# Altium schematic sheet TIDA-00830_DRV888x.SchDoc: DRV888xEVM Motor Driver Connections
size 431 x 279 mm; Date: Not shown in title block; ApprovedBy: Not shown in title block; CheckedBy: Not shown in title block; Author: Not shown in title block; CompanyName: Not shown in title block; Engineer: Not shown in title block; Organization: Not shown in title block; Address1: Not shown in title block; Address2: Not shown in title block; Address3: Not shown in title block; Address4: Not shown in title block; DocumentNumber: 1; Revision: Use project parameter SCH_Rev; SheetNumber: 1; SheetTotal: 3; PageSetup: Record=PageOptions|CenterHorizontal=True|CenterVertical=True|PrintScale=1.00|XCorrection=1.00|YCorrection=1.00|PrintKind=0|BorderSize=5000000|LeftOffset=0|BottomOffset=0|Orientation=2|PaperLength=1000|PaperWidth=1000|Scale=100|PaperSource=15|PrintQuality=600|MediaType=1|DitherType=10|PaperKind=Letter|PrintScaleMode=1; CurrentTime: Not shown in title block; CurrentDate: Not shown in title block; Time: Not shown in title block; DocumentFullPathAndName: Not shown in title block; DocumentName: Not shown in title block; ModifiedDate: Not shown in title block; ImagePath: Not shown in title block
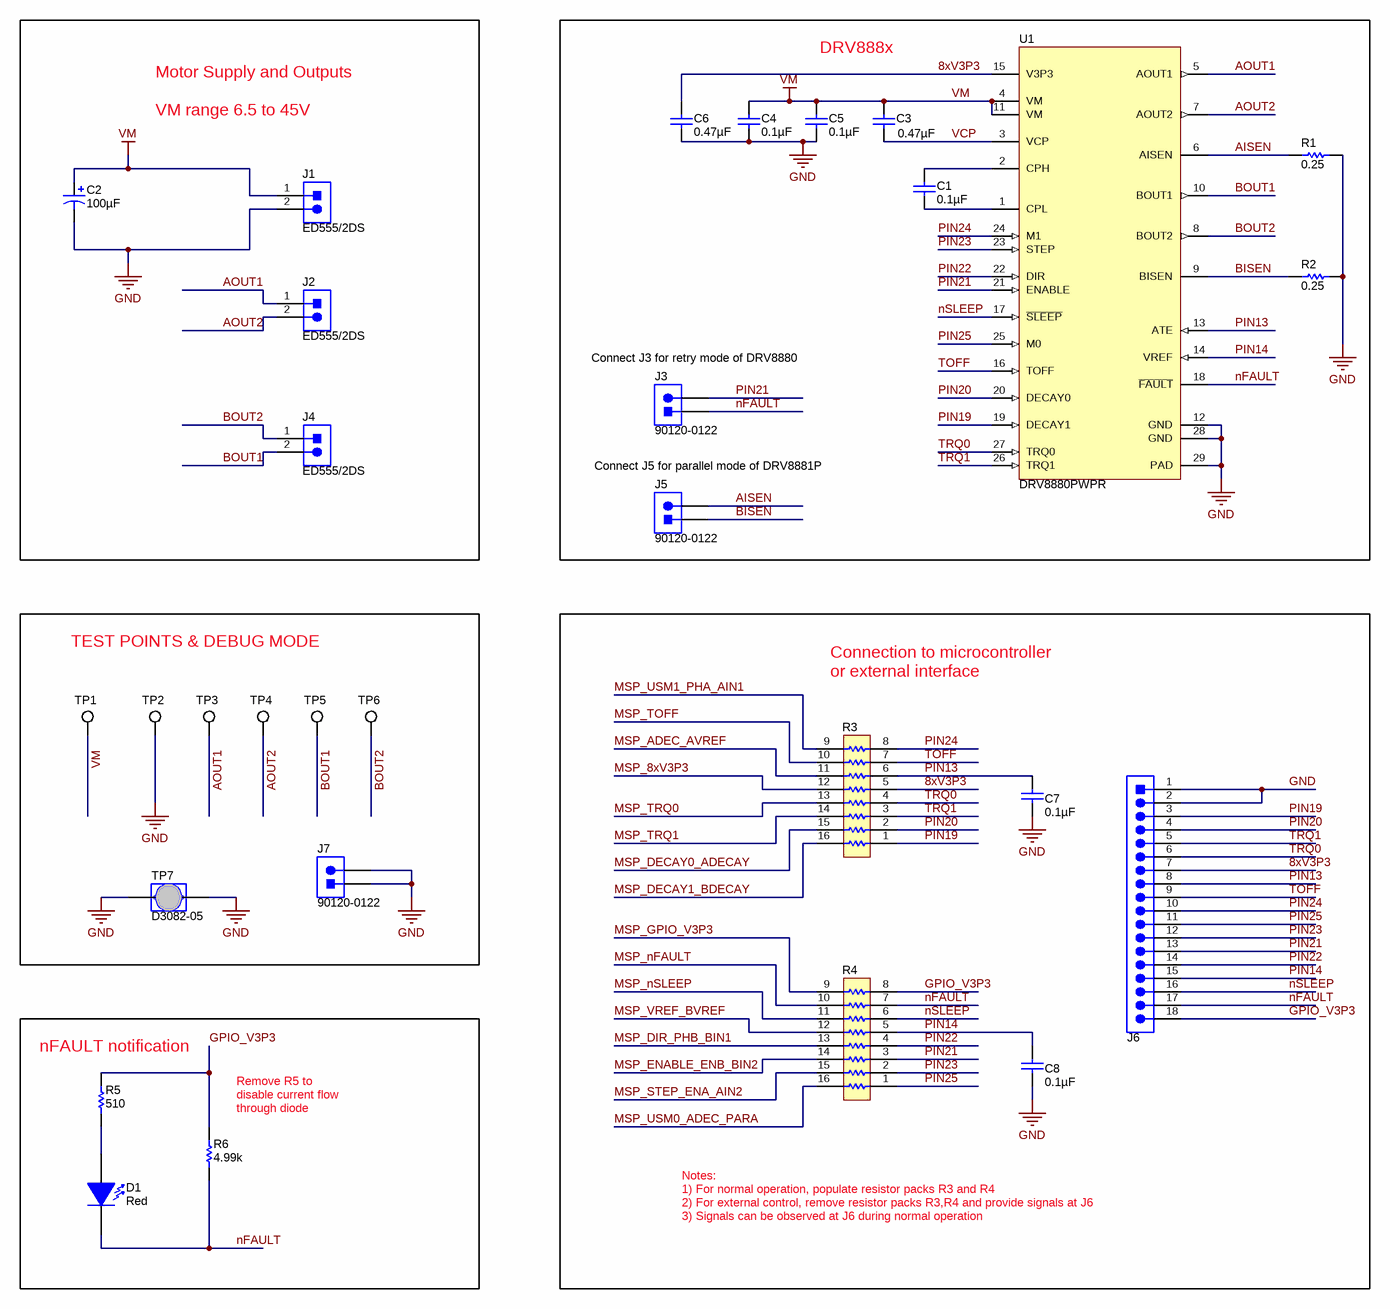
[diagram p0: TIDA-00830_DRV888x.SchDoc]

## Parts
C1  ValueDisplayed: 0.1µF  [0805L]  (hidden comment: C0805C104K1RACTU)
C2  ValueDisplayed: 100µF  [SM_RADIAL_G]  (hidden comment: EEE-FK1J101P)
C3  ValueDisplayed: 0.47µF  [0805L]  (hidden comment: C2012X7R1E474K)
C4  ValueDisplayed: 0.1µF  [0805L]  (hidden comment: C0805C104K1RACTU)
C5  ValueDisplayed: 0.1µF  [0805L]  (hidden comment: C0805C104K1RACTU)
C6  ValueDisplayed: 0.47µF  [0603L]  (hidden comment: C0603C474K9RACTU)
C7  ValueDisplayed: 0.1µF  [0402L]  (hidden comment: GRM155R61A104KA01D)
C8  ValueDisplayed: 0.1µF  [0402L]  (hidden comment: GRM155R61A104KA01D)
D1  value Red  [LED_LTST-C190_Red]  (hidden comment: LTST-C190CKT)
J1  ED555/2DS  [TERM_BLK_ED555-2DS]
J2  ED555/2DS  [TERM_BLK_ED555-2DS]
J3  90120-0122  [CONN_90120-0122]
J4  ED555/2DS  [TERM_BLK_ED555-2DS]
J5  90120-0122  [CONN_90120-0122]
J6  TSW-118-07-G-S  [TSW-118-07-G-S]  (value not drawn)
J7  90120-0122  [CONN_90120-0122]
R1  value 0.25  [2010L]  (hidden comment: CSRN2010FKR250)
R2  value 0.25  [2010L]  (hidden comment: CSRN2010FKR250)
R3  EXB-2HV330JV  [RESCAXS_EXB-2HV]  (value not drawn)
R4  EXB-2HV330JV  [RESCAXS_EXB-2HV]  (value not drawn)
R5  value 510  [0402L]  (hidden comment: CRCW0402510RJNED)
R6  value 4.99k  [0402L]  (hidden comment: CRCW04024K99FKED)
TP1  5016  [Testpoint_Keystone_Compact]  (value not drawn)
TP2  5016  [Testpoint_Keystone_Compact]  (value not drawn)
TP3  5016  [Testpoint_Keystone_Compact]  (value not drawn)
TP4  5016  [Testpoint_Keystone_Compact]  (value not drawn)
TP5  5016  [Testpoint_Keystone_Compact]  (value not drawn)
TP6  5016  [Testpoint_Keystone_Compact]  (value not drawn)
TP7  D3082-05  [Harwin_D3082-05]
U1  DRV8880PWPR  [PWP0028C_N]

## Blocks framed on the sheet
DRV888x: C1 C3-C6 J3 J5 R1 R2 U1
TEST POINTS & DEBUG MODE: J7 TP1-TP7
nFAULT notification: D1 R5 R6

## Nets
GND: C2.2(-) C4.1 C5.1 C6.2 C7.2 C8.2 J1.2 J6.1 J6.2 J7.1 J7.2 R1.1 R2.1 TP2.1 TP7.1 TP7.2 U1.12(GND) U1.28(GND) U1.29(PAD)
VM: C2.1(+) C3.2 C4.2 C5.2 J1.1 TP1.1 U1.4(VM) U1.11(VM)
8xV3P3: C6.1 J6.7 R3.5 U1.15(V3P3)
AISEN: J5.2 R1.2 U1.6(AISEN)
AOUT1: J2.1 TP3.1 U1.5(AOUT1)
AOUT2: J2.2 TP4.1 U1.7(AOUT2)
BISEN: J5.1 R2.2 U1.9(BISEN)
BOUT1: J4.2 TP5.1 U1.10(BOUT1)
BOUT2: J4.1 TP6.1 U1.8(BOUT2)
GPIO_V3P3: J6.18 R4.8 R5.2 R6.2
MSP_8xV3P3: R3.12
MSP_ADEC_AVREF: R3.11
MSP_DECAY0_ADECAY: R3.15
MSP_DECAY1_BDECAY: R3.16
MSP_DIR_PHB_BIN1: R4.13
MSP_ENABLE_ENB_BIN2: R4.14
MSP_GPIO_V3P3: R4.9
MSP_nFAULT: R4.10
MSP_nSLEEP: R4.11
MSP_STEP_ENA_AIN2: R4.15
MSP_TOFF: R3.10
MSP_TRQ0: R3.13
MSP_TRQ1: R3.14
MSP_USM0_ADEC_PARA: R4.16
MSP_USM1_PHA_AIN1: R3.9
MSP_VREF_BVREF: R4.12
nFAULT: D1.2(K) J3.1 J6.17 R4.7 R6.1 U1.18(~{FAULT})
nSLEEP: J6.16 R4.6 U1.17(~{SLEEP})
PIN13: C7.1 J6.8 R3.6 U1.13(ATE)
PIN14: C8.1 J6.15 R4.5 U1.14(VREF)
PIN19: J6.3 R3.1 U1.19(DECAY1)
PIN20: J6.4 R3.2 U1.20(DECAY0)
PIN21: J3.2 J6.13 R4.3 U1.21(ENABLE)
PIN22: J6.14 R4.4 U1.22(DIR)
PIN23: J6.12 R4.2 U1.23(STEP)
PIN24: J6.10 R3.8 U1.24(M1)
PIN25: J6.11 R4.1 U1.25(M0)
TOFF: J6.9 R3.7 U1.16(TOFF)
TRQ0: J6.6 R3.4 U1.27(TRQ0)
TRQ1: J6.5 R3.3 U1.26(TRQ1)
VCP: C3.1 U1.3(VCP)
NetC1_1: C1.1 U1.1(CPL)
NetC1_2: C1.2 U1.2(CPH)
NetD1_1: D1.1(A) R5.1

## Notes on the sheet
- Motor Supply and Outputs
  VM range 6.5 to 45V
- (near J3) Connect J3 for retry mode of DRV8880
- Connect J5 for parallel mode of DRV8881P
- Connection to microcontroller
  or external interface
- (near R6) Remove R5 to disable current flow through diode
- Notes:
  1) For normal operation, populate resistor packs R3 and R4
  2) For external control, remove resistor packs R3,R4 and provide signals at J6
  3) Signals can be observed at J6 during normal operation
- Drawn By:
- SVN Rev:
- Number:
- TID #:
- Orderable:
- Rev:
- Sheet Title:
- File:
- Project Title:
- Designed for:
- Assembly Variant:
- Mod. Date:
- Sheet:
- Size:
- of
- B
- http://www.ti.com
- Texas Instruments and/or its licensors do not warrant the accuracy or completeness of this specification or any information contained therein. Texas Instruments and/or its licensors do not warrant that this design will meet the specifications, will be suitable for your application or fit for any particular purpose, or will operate in an implementation. Texas Instruments and/or its licensors do not warrant that the design is production worthy. You should completely validate and test your design implementation to confirm the system functionality for your application.
- Engineer:
- Contact:
- © Texas Instruments

## Library data of the parts
C1 C4 C5 = C0805C104K1RACTU: CAP, CERM, 0.1 µF, 100 V, +/- 10%, X7R, 0805; Manufacturer: Kemet; Polarized: N; CompType: Capacitor; Value: 0.1uF; U/M: EA; Cap_F: 0.0000001; Tolerance_%: 10; ESR_ohm: 0.064; Value1: 0.064 ohm; VDC_V: 100; Value2: 100V; IRMS_A: 1.64; TaMin_C: -55; TaMax_C: 125; Cap_Case: 0805; SymbolVersion: 2008-07-09; PartNumber: C0805C104K1RACTU; PackageReference: 0805; RoHS: Y; MountType: SMT; Technology: Ceramic; TempCo: X7R; Published: 2008-06-19; Publisher: Texas Instruments; LatestRevisionDate: 2015-06-10; ComponentLink1Description: Datasheet link; ComponentLink1URL: http://www.kemet.com/kemet/web/homepage/kechome.nsf/file/Partial%20Copy%20-%20Ceramic%20Surface%20Mount%20Capacitors/$file/F3102_CE.pdf; Supplier 1: Digi-Key; Supplier Part Number 1: 399-3486-1-ND; Supplier 2: Mouser; Supplier Part Number 2: 80-C0805C104K1R; Supplier 3: Farnell; Supplier Part Number 3: 1650862
C2 = EEE-FK1J101P: CAP, AL, 100 µF, 63 V, +/- 20%, 0.35 ohm, SMD; Manufacturer: Panasonic; Value: 100uF; Polarized: Y; CompType: Capacitor; U/M: EA; Cap_F: 0.0001; Tolerance_%: 20; ESR_ohm: 0.35; VDC_V: 63; Value2: 63V; IRMS_A: 0.4; TaMin_C: -55; TaMax_C: 105; Cap_Case: G; SymbolVersion: 2008-07-09; PartNumber: EEE-FK1J101P; PackageReference: SMT Radial G; RoHS: Y; Value1: 0.35 ohm; MountType: SMT; Technology: AL; Publisher: Texas Instruments; LatestRevisionDate: 2015-06-10; ComponentLink1Description: Datasheet link; ComponentLink1URL: http://www.panasonic.com/industrial/components/pdf/smt_aec_050505.pdf; Supplier 1: Digi-Key; Supplier Part Number 1: PCE3819CT-ND; Supplier 2: Mouser; Supplier Part Number 2: 667-EEE-FK1J101P; Supplier 3: Farnell; Supplier Part Number 3: 9696040; Series: FK
C3 = C2012X7R1E474K: CAP, CERM, 0.47 µF, 25 V, +/- 10%, X7R, 0805; Manufacturer: TDK; Polarized: N; CompType: Capacitor; Value: 0.47uF; U/M: EA; Cap_F: 0.00000047; Tolerance_%: 10; ESR_ohm: 0.0101; Value1: 0.0101 ohm; VDC_V: 25; Value2: 25V; TaMin_C: -55; TaMax_C: 125; Cap_Case: 0805; SymbolVersion: 2008-07-09; PartNumber: C2012X7R1E474K; PackageReference: 0805; RoHS: Y; MountType: SMT; Technology: Ceramic; TempCo: X7R; Published: 2008-06-19; Publisher: Texas Instruments; LatestRevisionDate: 2015-06-10; ComponentLink1Description: Datasheet link; ComponentLink1URL: http://www.tdk.co.jp/tefe02/e412_c.pdf; Supplier 1: Digi-Key; Supplier Part Number 1: 445-1353-1-ND; Supplier 2: Farnell; Supplier Part Number 2: 1844282
C6 = C0603C474K9RACTU: CAP, CERM, 0.47 µF, 6.3 V, +/- 10%, X7R, 0603; Manufacturer: Kemet; Polarized: N; CompType: Capacitor; Value: 0.47uF; U/M: EA; Cap_F: 0.00000047; Tolerance_%: 10; Value1: Unknown; VDC_V: 6.3; Value2: 6.3V; TaMin_C: -55; TaMax_C: 125; Cap_Case: 0603; SymbolVersion: 2008-07-09; PartNumber: C0603C474K9RACTU; PackageReference: 0603; RoHS: Y; MountType: SMT; Technology: Ceramic; TempCo: X7R; Published: 2008-06-19; Publisher: Texas Instruments; LatestRevisionDate: 2015-06-10; ComponentLink1Description: Datasheet link; ComponentLink1URL: http://www.kemet.com/kemet/web/homepage/kechome.nsf/vapubfiles/F3102_Y5V.pdf/$file/F3102_Y5V.pdf; Supplier 1: Digi-Key; Supplier Part Number 1: 399-4924-1-ND; Supplier 2: Mouser; Supplier Part Number 2: 80-C0603C474K9R
C7 C8 = GRM155R61A104KA01D: CAP, CERM, 0.1 µF, 10 V, +/- 10%, X5R, 0402; Manufacturer: MuRata; Value: 0.1uF; Polarized: N; CompType: Capacitor; U/M: EA; Cap_F: 0.0000001; Tolerance_%: 10; Value1: Unknown; Value2: 10V; TaMin_C: -55; TaMax_C: 85; Cap_Case: 0402; SymbolVersion: 2008-07-09; PartNumber: GRM155R61A104KA01D; PackageReference: 0402; RoHS: Y; VDC_V: 10; MountType: SMT; Technology: Ceramic; TempCo: X5R; Published: 2008-06-19; Publisher: Texas Instruments; LatestRevisionDate: 2015-06-10; ComponentLink1Description: Datasheet link; ComponentLink1URL: http://search.murata.co.jp/Ceramy/PnsearchViewAction.do?HnOFG=ON&HnNFG=ON&SEL_CNT=50&sLang=en&sKey=GRM155R61A104KA01D&x=9&y=9&search=startwith; Supplier 1: Digi-Key; Supplier Part Number 1: 490-1318-1-ND; Supplier 2: Mouser; Supplier Part Number 2: 81-GRM155R61A104KA01; Supplier 3: Farnell; Supplier Part Number 3: 1828862
D1 = LTST-C190CKT: LED, Red, SMD; Manufacturer: Lite-On; Vf_V: 2; Value2: 2V; Io_A: 0.02; Tjmax_C: 85; Power_TotalModule: 0.0625; Value1: 0.0625W; U/M: EA; ComponentLink1URL: http://optoelectronics.liteon.com/en-us/api/DwonloadFileHandler.ashx?txtSpecNo=DS-22-98-0009&txtPartNo=LTST-C190CKT; SymbolVersion: 2008-12-08; PackageReference: Red LED, 1.6x0.8x0.8mm; PartNumber: LTST-C190CKT; ComponentLink1Description: Datasheet link; Supplier 1: Digi-Key; Supplier Part Number 1: 160-1181-1-ND; MountType: SMT; CompType: LED; RoHS: Y; Type: ?; Color: red; Published: 2008-07-11; Publisher: Texas Instruments; LatestRevisionDate: 2015-06-04; Supplier 2: Mouser; Supplier Part Number 2: 859-LTST-C190CKT
J1 J2 J4 = ED555/2DS: Terminal Block, 6A, 3.5mm Pitch, 2-Pos, TH; Manufacturer: On-Shore Technology; SymbolCreator: a0412235; CompType: Connector; U/M: EA; ComponentLink1URL: http://on-shore.com/sites/default/files/manuals/ed555ds.pdf; SymbolVersion: 2013-10-31; PackageReference: 7.0x8.2x6.5mm; PartNumber: ED555/2DS; ComponentLink1Description: Datasheet Link; RoHS: Y; MountType: TH; Publisher: Texas Instruments; LatestRevisionDate: 2015-06-10; Supplier 1: Digi-Key; Supplier Part Number 1: ED1514-ND
J3 J5 J7 = 90120-0122: Header, 100mil, 2x1, Tin, TH; Manufacturer: Molex; SymbolCreator: a0412235; U/M: EA; SymbolVersion: 2013-10-31; PartNumber: 90120-0122; PackageReference: Header 2x1; CompType: Header; RoHS: Y; MountType: TH; ComponentLink1Description: Datasheet Link; ComponentLink1URL: http://www.molex.com/pdm_docs/sd/901200122_sd.pdf; Publisher: Texas Instruments; LatestRevisionDate: 2015-06-11; Supplier 1: Digi-Key; Supplier Part Number 1: WM8072-ND; Supplier 2: Mouser; Supplier Part Number 2: 538-90120-0122; Supplier 3: Newark; Supplier Part Number 3: 19M8215; ClassName: Header
J6 = TSW-118-07-G-S: Header, 100mil, 18x1, Gold, TH; Manufacturer: Samtec; SymbolCreator: a0411947; U/M: EA; ComponentLink1URL: http://samtec.com/ftppub/pdf/TSW_TH.PDF; SymbolVersion: 2013-12-22; PackageReference: 18x1 Header; PartNumber: TSW-118-07-G-S; ComponentLink1Description: Datasheet Link; Supplier 1: Digi-Key; Supplier Part Number 1: SAM1029-18-ND; MountType: TH; ClassName: Header; CompType: Header; RoHS: Y; Publisher: Texas Instruments; LatestRevisionDate: 2015-06-08
R1 R2 = CSRN2010FKR250: RES, 0.25, 1%, 1 W, 2010; Manufacturer: Stackpole Electronics Inc; CompType: Resistor; Value_Code: R250; Tolerance_%: 1; Value2: 1W; TempCo: 250 ppm/C; U/M: EA; SymbolVersion: 2009-05-29; PartNumber: CSRN2010FKR250; PackageReference: 2010; RoHS: Y; Res_ohm: 0.25; Value1: 1%; Power_W: 1; MountType: SMT; Technology: Thick Film; Published: 2008-06-26; Publisher: Texas Instruments; LatestRevisionDate: 2015-04-13; ComponentLink1Description: Datasheet link; ComponentLink1URL: http://www.seielect.com/Catalog/SEI-csr.pdf; Supplier 1: Digi-Key; Supplier Part Number 1: CSRN2010FKR250CT-ND; ValueDisplayed: 0.25
R3 R4 = EXB-2HV330JV: RES, 33, 5%, 0.0625 W, Resistor Array - 8x1; Manufacturer: Panasonic; SymbolCreator: a0411947; Res_ohm: 33; Value: 33; Value_Code: 33R0; Tolerance_%: 5; Power_W: 0.0625; TempCo: 200 ppm/C; EIA_Code: E24; U/M: EA; SymbolVersion: 2013-05-25; PartNumber: EXB-2HV330JV; PackageReference: Resistor Array - 8x1; RoHS: Y; CompType: Resistor; Value1: 5%; Value2: 0.0625W; MountType: SMT; Technology: Thick Film; Published: 2008-06-26; Publisher: Texas Instruments; LatestRevisionDate: 2015-06-01; ComponentLink1Description: Datasheet link; ComponentLink1URL: http://industrial.panasonic.com/www-data/pdf/AOC0000/AOC0000CE1.pdf; Supplier 1: Digi-Key; Supplier Part Number 1: Y1330CT-ND; Supplier 2: Mouser; Supplier Part Number 2: 667-EXB-2HV330JV; Supplier 3: Farnell; Supplier Part Number 3: 2060066; ValueDisplayed: 33
R5 = CRCW0402510RJNED: RES, 510, 5%, 0.063 W, 0402; Manufacturer: Vishay-Dale; CompType: Resistor; Value_Code: 510R; Tolerance_%: 5; Power_W: 0.063; Value2: 0.063W; VDC_V: 50; TempCo: 200 ppm/C; EIA_Code: E24; U/M: EA; SymbolVersion: 2009-05-29; PartNumber: CRCW0402510RJNED; PackageReference: 0402; RoHS: Y; Res_ohm: 510; Value1: 5%; MountType: SMT; Technology: Thick Film; Published: 2008-06-26; Publisher: Texas Instruments; LatestRevisionDate: 2015-05-27; ComponentLink1Description: Datasheet link; ComponentLink1URL: http://www.vishay.com/docs/20035/dcrcwe3.pdf; Supplier 1: Digi-Key; Supplier Part Number 1: 541-510JCT-ND; Supplier 2: Mouser; Supplier Part Number 2: 71-CRCW0402J-510-E3; Supplier 3: Farnell; Supplier Part Number 3: 1570682; ValueDisplayed: 510
R6 = CRCW04024K99FKED: RES, 4.99 k, 1%, 0.063 W, 0402; Manufacturer: Vishay-Dale; CompType: Resistor; Res_ohm: 4990; Value_Code: 4k99; Tolerance_%: 1; Power_W: 0.063; Value2: 0.063W; VDC_V: 50; TempCo: 100 ppm/C; EIA_Code: E96; U/M: EA; SymbolVersion: 2009-05-29; PartNumber: CRCW04024K99FKED; PackageReference: 0402; RoHS: Y; Value1: 1%; MountType: SMT; Technology: Thick Film; Published: 2008-06-26; Publisher: Texas Instruments; LatestRevisionDate: 2015-05-27; ComponentLink1Description: Datasheet link; ComponentLink1URL: http://www.vishay.com/docs/20035/dcrcwe3.pdf; Supplier 1: Digi-Key; Supplier Part Number 1: 541-4.99KLCT-ND; Supplier 2: Mouser; Supplier Part Number 2: 71-CRCW0402-4.99K-E3; Supplier 3: Farnell; Supplier Part Number 3: 1469715; ValueDisplayed: 4.99k
TP1-TP6 = 5016: Test Point, Compact, SMT; Manufacturer: Keystone; CompType: Test Point Loop; U/M: EA; SymbolVersion: 2008-04-04; PartNumber: 5016; Value: SMT; RoHS: Y; PackageReference: Testpoint_Keystone_Compact; MountType: SMT; ComponentLink1Description: Datasheet Link; ComponentLink1URL: http://www.keyelco.com/userAssets/store/files/5016.PDF; Publisher: Texas Instruments; LatestRevisionDate: 2015-05-13; Supplier 1: Digi-Key; Supplier Part Number 1: 5016KCT-ND
TP7 = D3082-05: 1mm Uninsulated Shorting Plug, 10.16mm spacing, TH; Manufacturer: Harwin; SymbolCreator: a0799628; CompType: Jumper Wire; U/M: EA; SymbolVersion: 2014-05-16; MountType: TH; RoHS: Y; PartNumber: D3082-05; PackageReference: Shorting Plug, 10.16mm spacing, TH; ComponentLink1Description: Datasheet Link; ComponentLink1URL: http://cdn.harwin.com/pdfs/D3080-D3083.pdf; Supplier 1: Digi-Key; Supplier 2: Mouser; Supplier Part Number 1: 952-1873-ND; Supplier Part Number 2: 855-D3082-05; Publisher: Texas Instruments; LatestRevisionDate: 2015-06-10
U1 = DRV8880PWPR: 2-A 45-V 1/16-μstep Stepper Motor Driver With AutoTune, PWP0028C; Manufacturer: Texas Instruments; SymbolCreator: Altium; CompType: IC; U/M: EA; SymbolVersion: 2015-05-04; PartNumber: DRV8880PWPR; Alternate PartNumber: DRV8880PWP; PackageReference: PWP0028C; MountType: SMT; ComponentLink1Description: Datasheet Link; ComponentLink1URL: https://sps06.itg.ti.com/sites/KMS/crossdivteams/altium/docs/ComponentDatasheets/SLVSD18_060515.pdf; Publisher: Texas Instruments; LatestRevisionDate: 2015-06-11; Alternate Manufacturer: Texas Instruments